# EAGLE design BHOnOfreSquareBoard (EAGLE 8.3.2)
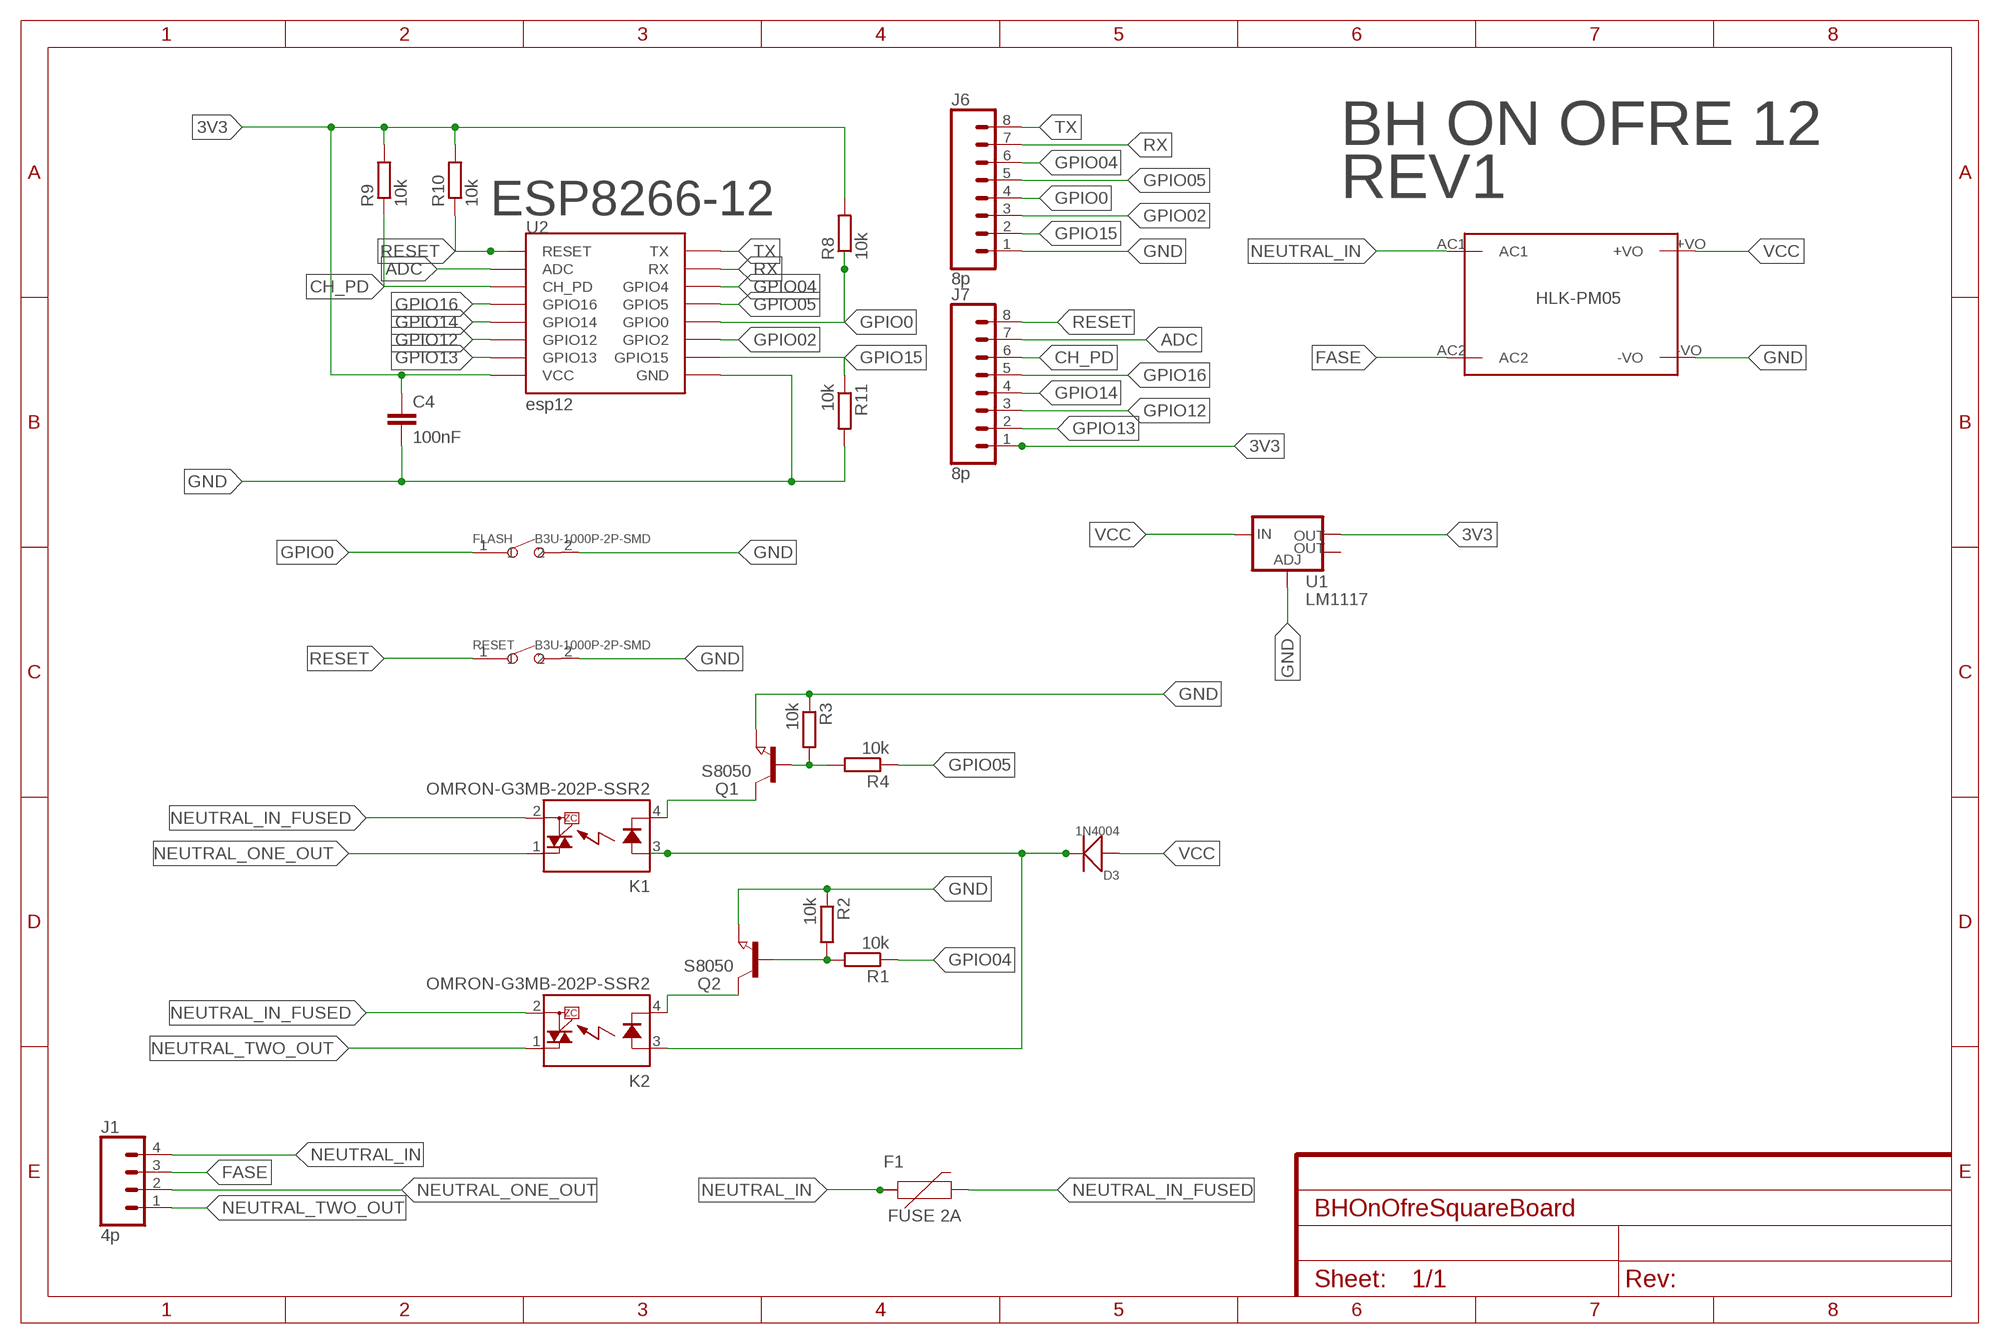
[diagram p0: schematic, sheet 1]

## Parts
C4  100nF  10NF-0603-50V-10%  [0603]
D3  1N4004  DIODE-GEN-PURPOSE-1KV-1A(DO-214AC)  [DO-214AC]
F1  FUSE 2A  PPTC_PTH  [PTH]
FLASH  B3U-1000P-2P-SMD  SMD-BUTTON(2P-3.0X2.5X1.2+0.4MM)-B3U-1000P-2P-SMD  [SW2-2.6-3.0X2.5X1.2+0.4MM]
J1  4p  CONN_04SCREW  [SCREWTERMINAL-3.5MM-4]
J6  8p  CONN_08"  [1X08]
J7  8p  CONN_08"  [1X08]
K1  OMRON-G3MB-202P-SSR2  [OMRON-G3MB-202P-SSR]
K2  OMRON-G3MB-202P-SSR2  [OMRON-G3MB-202P-SSR]
Q1  S8050  NPN-TRANSISTOR_SOT23  [SOT23]
Q2  S8050  NPN-TRANSISTOR_SOT23  [SOT23]
R1  10k  R-EU_R0603  [R0603]
R2  10k  R-EU_R0603  [R0603]
R3  10k  R-EU_R0603  [R0603]
R4  10k  R-EU_R0603  [R0603]
R8  10k  R-EU_R0603  [R0603]
R9  10k  R-EU_R0603  [R0603]
R10  10k  R-EU_R0603  [R0603]
R11  10k  R-EU_R0603  [R0603]
RESET  B3U-1000P-2P-SMD  SMD-BUTTON(2P-3.0X2.5X1.2+0.4MM)-B3U-1000P-2P-SMD  [SW2-2.6-3.0X2.5X1.2+0.4MM]
U1  LM1117  V_REG_LM1117SOT223  [SOT223]
U2  esp12  ESP12SMD  [ESP12-SMD]
U$2  HLK-PM03  [HLK-PM03]

## Nets
3V3: C4.1 J7.1 R8.2 R9.2 R10.2 U1.2(OUT) U2.VCC
ADC: J7.7 U2.ADC
CH_PD: J7.6 R9.1 U2.CH_PD
FASE: J1.3 U$2.AC2
GND: C4.2 FLASH.2 J6.1 Q1.2(E) Q2.2(E) R2.1 R3.1 R11.2 RESET.2 U1.1(ADJ) U2.GND U$2.-VO
GPIO0: FLASH.1 J6.4 R8.1 U2.GPIO0
GPIO02: J6.3 U2.GPIO2
GPIO04: J6.6 R1.1 U2.GPIO4
GPIO05: J6.5 R4.1 U2.GPIO5
GPIO12: J7.3 U2.GPIO12
GPIO13: J7.2 U2.GPIO13
GPIO14: J7.4 U2.GPIO14
GPIO15: J6.2 R11.1 U2.GPIO15
GPIO16: J7.5 U2.GPIO16
N$1: K1.4(K) Q1.3(C)
N$2: D3.2(-) K1.3(A) K2.3(A)
N$7: Q1.1(B) R3.2 R4.2
N$9: K2.4(K) Q2.3(C)
N$13: Q2.1(B) R1.2 R2.2
NEUTRAL_IN: F1.P$1 J1.4 U$2.AC1
NEUTRAL_IN_FUSED: F1.P$2 K1.2(DS2) K2.2(DS2)
NEUTRAL_ONE_OUT: J1.2 K1.1(DS1)
NEUTRAL_TWO_OUT: J1.1 K2.1(DS1)
RESET: J7.8 R10.1 RESET.1 U2.RESET
RX: J6.7 U2.RXD0(RX)
TX: J6.8 U2.TXD0(TX)
VCC: D3.1(+) U1.3(IN) U$2.+VO
Unconnected: U1.4(OUT)

## Notes on the sheet
- BH ON OFRE 12
- REV1
- ESP8266-12
- HLK-PM05

## Library data of the parts
C4 = SparkFun-Capacitors:10NF: 0.01uF/10nF/10,000pF ceramic capacitors A capacitor is a passive two-terminal electrical component used to store electrical energy temporarily in an electric field. CAP-09321; PROD_ID: CAP-00867; VALUE: 10nF
D3 = Seeed-Diode:DIODE-GEN-PURPOSE-1KV-1A(DO-214AC): 304010013; MPN: 1N4007; VALUE: 1N4007
F1 = SparkFun-Fuses:PPTC: Resettable Fuse PPTC Resettable Fuse. Really a sort of resistor with a polymeric positive temperature coefficient whose resistance increases dramatically with an increase in temperature. When heated by the power passing through the resistance rises causing the current to be limited, protecting the circuit. This is achieved by the transition of the polymer from a crystalline to an amorphous state where the conductive carbon separates breaking the conductive pathways found in the cool crystalline structure. When a PPTC cools back down it resumes conducting letting the circuit turn back on. SparkFun Products: SparkFun RedBoard - Programmed with Arduino <https://www.sparkfun.com/products/12757> Pro Micro - 5V/16MHz <https://www.sparkfun.com/products/12640> Arduino Pro 328 - 5V/16MHz <https://www.sparkfun.com/products/10915> MP3 Trigger <https://www.sparkfun.com/products/13720>; PROD_ID: RES-08490; VALUE: 72V/0.25A
FLASH RESET = Seeed-Switch:SMD-BUTTON(2P-3.0X2.5X1.2+0.4MM): 311020047; MPN: B3U-1000P-2P-SMD
J1 = SparkFun-Connectors:CONN_04: Multi connection point. Often used as Generic Header-pin footprint for 0.1 inch spaced/style header connections On any of the 0.1 inch spaced packages, you can populate with these: Break Away Headers - Straight <https://www.sparkfun.com/products/116> (PRT-00116) Break Away Male Headers - Right Angle <https://www.sparkfun.com/products/553> (PRT-00553) Female Headers <https://www.sparkfun.com/products/115> (PRT-00115) Break Away Headers - Machine Pin <https://www.sparkfun.com/products/117> (PRT-00117) Break Away Female Headers - Swiss Machine Pin <https://www.sparkfun.com/products/743> (PRT-00743) For SCREWTERMINALS and SPRING TERMINALS visit here: Screw Terimnals on SparkFun.com <https://www.sparkfun.com/search/results?term=Screw+Terminals> (5mm/3.5mm/2.54mm spacing) This device is also useful as a general connection point to wire up your design to another part of your project. Our various solder wires solder well into these plated through hole pads. Hook-Up Wire - Assortment (Stranded, 22 AWG) <https://www.sparkfun.com/products/11375> (PRT-11375) Hook-Up Wire - Assortment (Solid Core, 22 AWG) <https://www.sparkfun.com/products/11367> (PRT-11367) View the entire wire category on our website here <https://www.sparkfun.com/categories/141> Special notes: Molex polarized connector foot print use with SKU : PRT-08231 with associated crimp pins and housings. 1MM SMD Version SKU: PRT-10208; PROD_ID: 2xCONN-08399; SF_ID: 2xPRT-08084
J6 J7 = SparkFun-Connectors:CONN_08: Multi connection point. Often used as Generic Header-pin footprint for 0.1 inch spaced/style header connections On any of the 0.1 inch spaced packages, you can populate with these: Break Away Headers - Straight <https://www.sparkfun.com/products/116> (PRT-00116) Break Away Male Headers - Right Angle <https://www.sparkfun.com/products/553> (PRT-00553) Female Headers <https://www.sparkfun.com/products/115> (PRT-00115) Break Away Headers - Machine Pin <https://www.sparkfun.com/products/117> (PRT-00117) Break Away Female Headers - Swiss Machine Pin <https://www.sparkfun.com/products/743> (PRT-00743) Arduino Stackable Header - 8 Pin <https://www.sparkfun.com/products/9279> (PRT-09279) For SCREWTERMINALS and SPRING TERMINALS visit here: Screw Terimnals on SparkFun.com <https://www.sparkfun.com/search/results?term=Screw+Terminals> (5mm/3.5mm/2.54mm spacing) This device is also useful as a general connection point to wire up your design to another part of your project. Our various solder wires solder well into these plated through hole pads. Hook-Up Wire - Assortment (Stranded, 22 AWG) <https://www.sparkfun.com/products/11375> (PRT-11375) Hook-Up Wire - Assortment (Solid Core, 22 AWG) <https://www.sparkfun.com/products/11367> (PRT-11367) View the entire wire category on our website here <https://www.sparkfun.com/categories/141> Special notes: Molex polarized connector foot print use with SKU : PRT-08231 with associated crimp pins and housings. 1MM SMD Version SKU: PRT-10208 NOTES ON THE VARIANTS LOCK and LOCK_LONGPADS... This footprint was designed to help hold the alignment of a through-hole component (i.e. 6-pin header) while soldering it into place. You may notice that each hole has been shifted either up or down by 0.005 of an inch from it's more standard position (which is a perfectly straight line). This slight alteration caused the pins (the squares in the middle) to touch the edges of the holes. Because they are alternating, it causes a "brace" to hold the component in place. 0.005 has proven to be the perfect amount of "off-center" position when using our standard breakaway headers. Although looks a little odd when you look at the bare footprint, once you have a header in there, the alteration is very hard to notice. Also,if you push a header all the way into place, it is covered up entirely on the bottom side.; PROD_ID: CONN-08438
K1 K2 = Omron G3MB 202p SSR:OMRON-G3MB-202P-SSR: IT(rms) 8A, Zero Cross type SIP 4pin Triac output SSR Source: http://sharp-world.com/products/device/lineup/data/pdf/datasheet/s102s02_e.pdf; MPN: S202S02F; OC_FARNELL: 1618475; OC_NEWARK: 14N9588
Q1 Q2 = semicon-smd-ipc:NPN-TRANSISTOR_: NPN TRANSISTOR
R1-R4 R8-R11 = resistor:R-EU_: RESISTOR, European symbol
U1 = SparkFun-IC-Power:V_REG_LM1117: Voltage Regulator LM1117 Standard adjustable voltage regulator but in SMD form. Spark Fun Electronics SKU : COM-00595; PROD_ID: VREG-08170
U2 = esp8266modules:ESP12: ESP8266 Wifi module 12
U$2 = PowerSocket:HLK-PM03

## Net classes
1 220V: clearance 2.54 mm

## Board
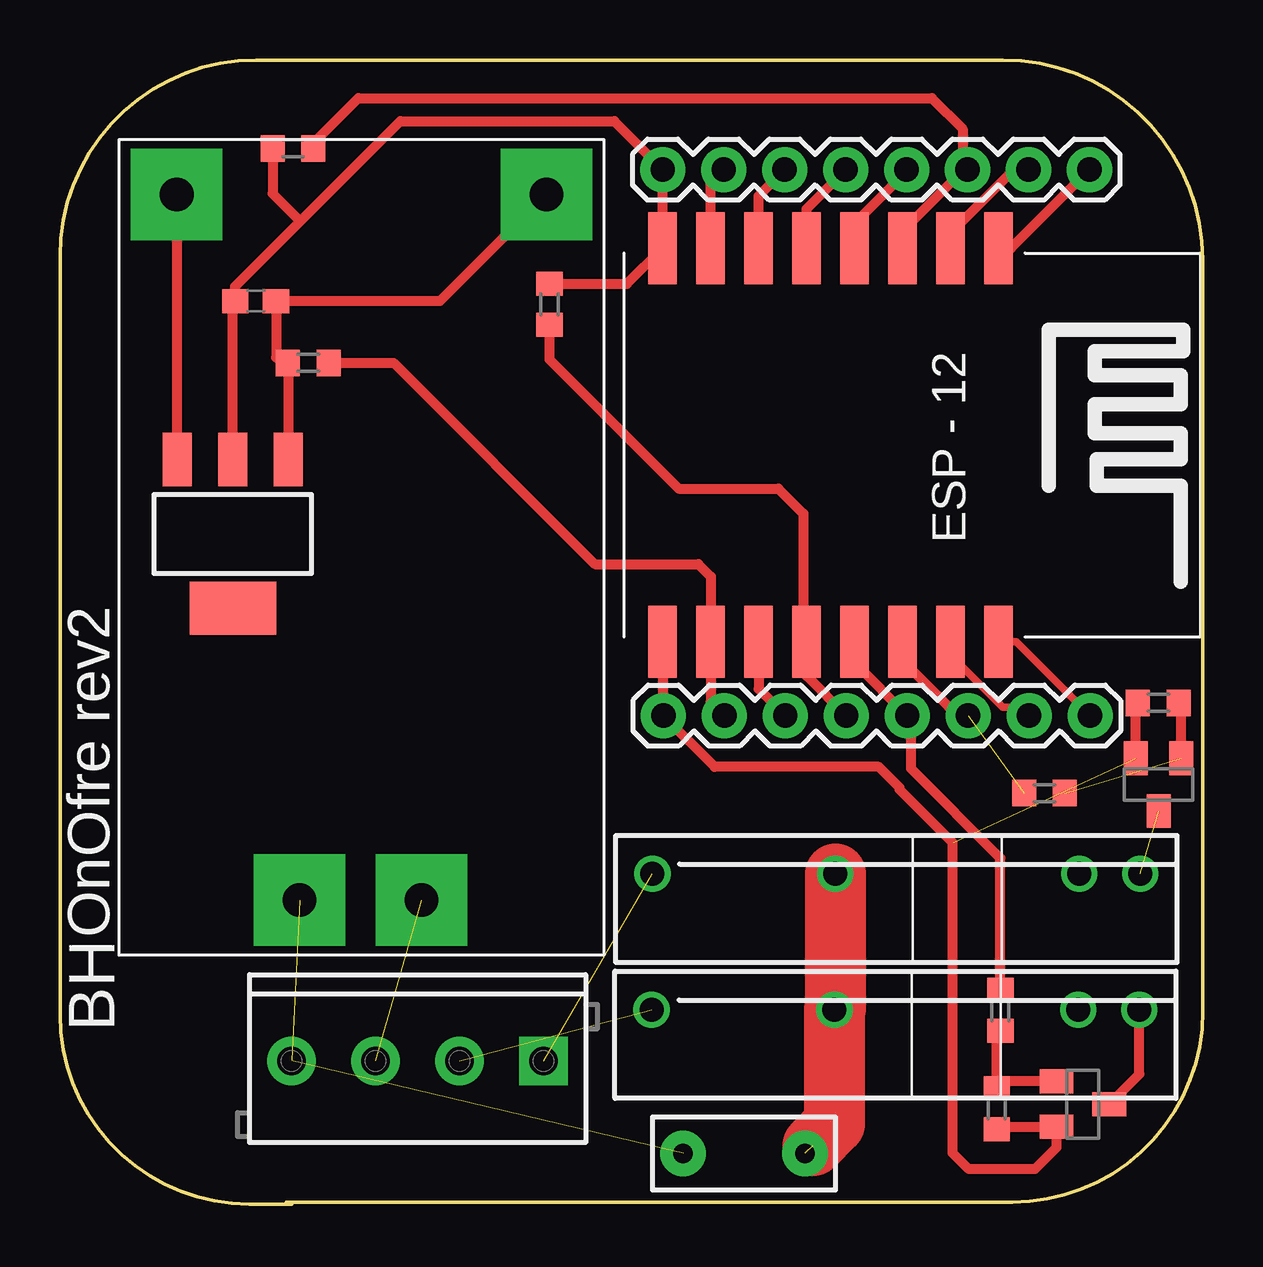
[diagram p1: board, top side]
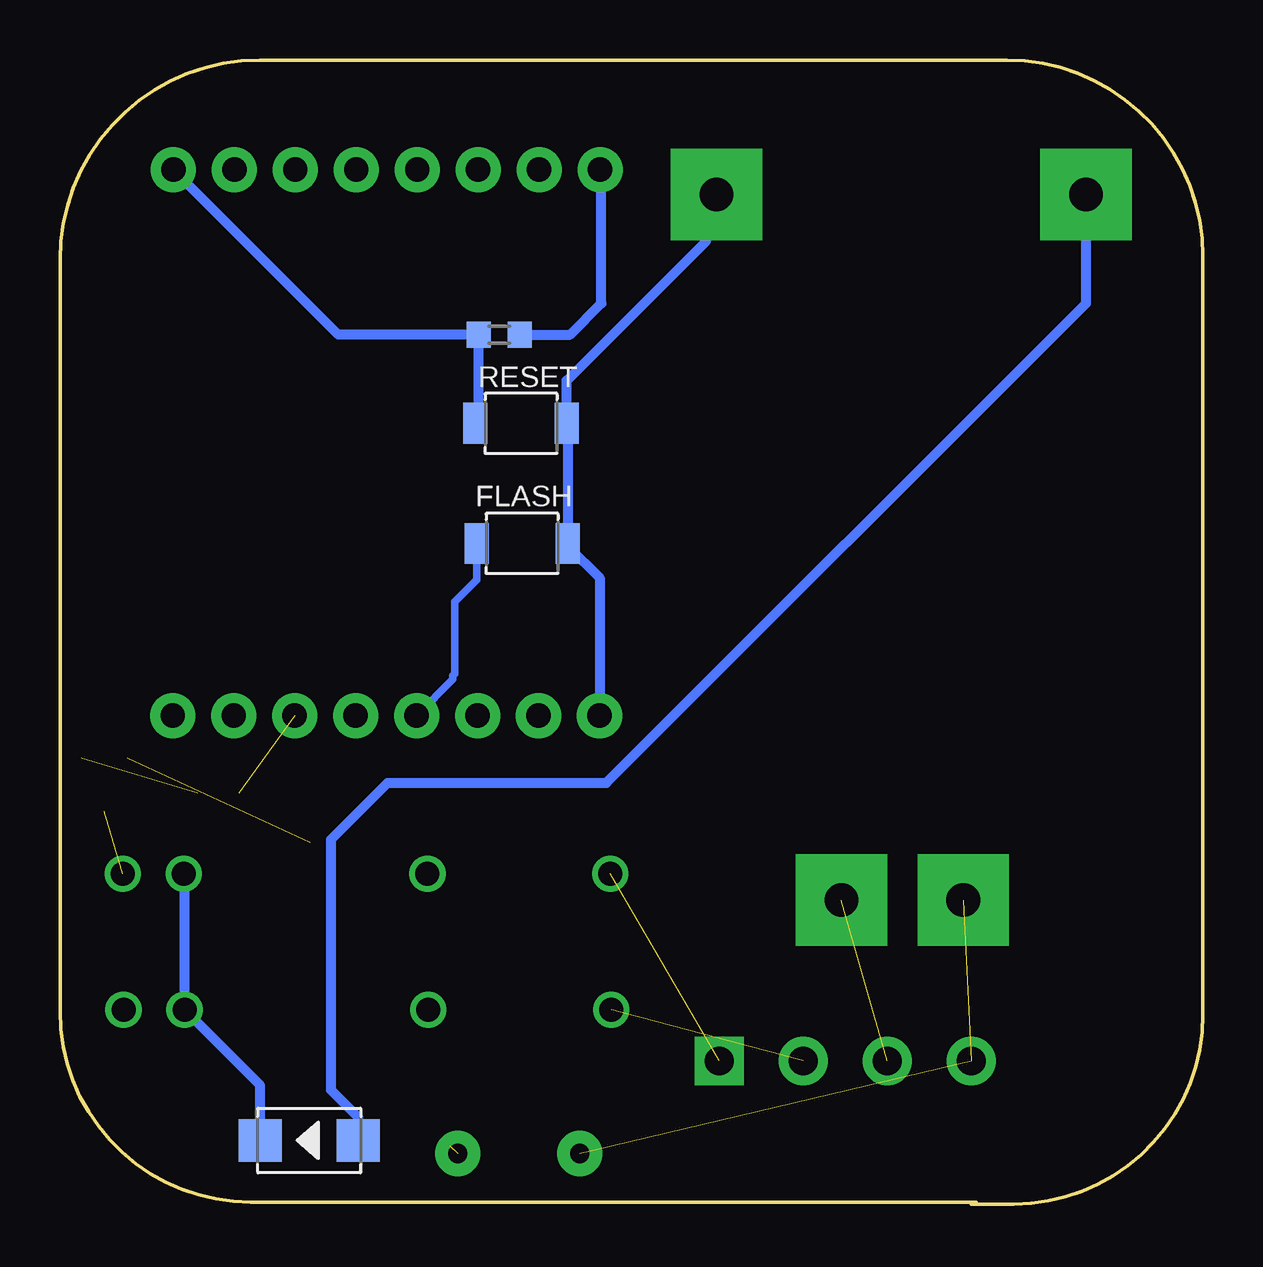
[diagram p2: board, bottom side, seen from below]

Size 47.62 x 47.67 mm. Coordinates in mm from the lower left corner, seen from the top.
Outline: 9.66,0 7.88,0 arc-90 0,7.88 0,39.5 arc-90 8.17,47.67 39.29,47.67 arc-90 47.62,39.34 47.62,8.02 arc-90 39.67,0.07 9.44,0.07
Copper layers (1*16): Top 0.035mm / dielectric 1.5mm / Bottom 0.035mm
Design rules "default": minimum track width 6mil, minimum drill 0.35mm, track to track 6mil, track to pad 6mil, pad to pad 6mil, via to via 6mil, smd to smd 6mil, copper to edge 40mil, drill to drill 6mil, minimum pad ring 10mil, minimum via ring 8mil, stop-mask expansion 4mil, vias tented up to drill 0mil, thermal gap 10mil

### Footprints (pad centres in the part's own frame; a part is rotated, then mirrored left to right if it is on the bottom)
0603 = smd 1.1 x 1: 1 -0.85,0; 2 0.85,0
DO-214AC = smd 1.8 x 1.77: 1 -2.042,0; 2 2.042,0
PTH = drill 0.8 pad 1.88: P$1 -2.54,0; P$2 2.54,0
SW2-2.6-3.0X2.5X1.2+0.4MM = smd 1 x 1.7: 1 -1.9,0; 2 1.9,0
SCREWTERMINAL-3.5MM-4 = drill 1.2 pad 2.032 square: 1 0,0 | drill 1.2 pad 2.032: 2 3.5,0; 3 7,0; 4 10.5,0
1X08 = drill 1.016 pad 1.88: 1 0,0; 2 2.54,0; 3 5.08,0; 4 7.62,0; 5 10.16,0; 6 12.7,0; 7 15.24,0; 8 17.78,0
OMRON-G3MB-202P-SSR = drill 1: 1 -12.7,0; 2 -5.08,0; 3 5.08,0; 4 7.62,0
SOT23 = smd 1 x 1.4: 1 -0.95,-1.1; 2 0.95,-1.1; 3 0,1.1
R0603 = smd 1 x 1.1: 1 -0.85,0; 2 0.85,0
SOT223 = smd 1.219 x 2.235: 1 -2.311,-3.099; 2 0,-3.099; 3 2.311,-3.099 | smd 3.6 x 2.2: 4 0,3.099
ESP12-SMD = smd 3 x 1.2: ADC -8.3,3.8; CH_PD -8.3,1.8; GND 8.1,-8.2; GPIO0 8.1,-2.2; GPIO2 8.1,-4.2; GPIO4 8.1,1.8; GPIO5 8.1,-0.2; GPIO12 -8.3,-4.2; GPIO13 -8.3,-6.2; GPIO14 -8.3,-2.2; GPIO15 8.1,-6.2; GPIO16 -8.3,-0.2; RESET -8.3,5.8; RXD0 8.1,3.8; TXD0 8.1,5.8; VCC -8.3,-8.2
HLK-PM03 = drill 1.4 pad 3.81 square: +VO 29.4,10.2; -VO 29.4,-5.2; AC1 0,5.08; AC2 0,0

### Placement (x,y rotation side)
C4  8.15,37.62 0 top
D3  37.23,2.65 180 bottom
F1  28.5,2.11 0 top
FLASH  28.36,27.52 0 bottom
J1  20.15,5.96 180 top
J6  25.14,20.35 0 top
J7  25.11,43.1 0 top
K1  37.35,8.1 0 top
K2  37.39,13.76 0 top
Q1  42.62,4.16 270 top
Q2  45.77,17.48 180 top
R1  41.02,17.12 0 top
R2  45.77,20.88 0 top
R3  39.03,3.98 90 top
R4  39.18,8.07 270 top
R8  20.39,37.49 90 top
R9  9.7,43.99 180 top
R10  29.32,36.22 0 bottom
R11  10.34,35.05 180 top
RESET  28.41,32.53 0 bottom
U1  7.2,27.92 180 top
U2  33.31,31.52 270 top
U$2  15.06,12.66 90 top

### Tracks (layer width: path | path; a pad name or v marks a point on that pad's centre or on a via)
3V3
  Top 0.406: 7.47,31.77 7.2,31.5 U1.2 7.2,37.52 C4.1 7.3,38.23 10.01,40.94 | 10.01,40.94 14.19,45.12 23.1,45.12 J7.1 U2.VCC 23.62,38.34 R8.2 | R9.2 8.85,42.1 10.01,40.94
  Bottom 0.406: R10.2 26.36,36.22 25.06,37.52 25.06,43.04 J7.1
ADC
  Top 0.406: J7.7 39.74,43.1 37.2,40.56 37.2,39.24 37.2,39.72 U2.ADC
CH_PD
  Top 0.406: R9.1 10.55,44.2 12.43,46.08 36.33,46.08 37.6,44.8 37.6,43.31 J7.6 37.66,43.1 35.25,40.68 35.25,39.96 U2.CH_PD
FASE  (1 unrouted)
GND  (1 unrouted)
  Top 0.406: Q2.2 44.83,20.79 R2.1 | R3.1 arc-90 39.12,3.21 Q1.2 41.52,2.35 40.62,1.45 37.87,1.45 37.19,2.13 37.19,15.06 36.25,16.01 34.99,17.27 34.99,17.35 34.12,18.22 27.28,18.22 J6.1 25.14,23.39 U2.GND | U$2.-VO 15.83,37.62 C4.2 9,35.28 9.51,34.77 | 9.51,34.77 U1.1 | 9.51,34.77 9.51,35.03 R11.2
  Bottom 0.406: 25.1,20.4 J6.1 25.14,26.09 26.46,27.41 FLASH.2 26.46,32.48 RESET.2 26.51,34.31 20.7,40.12 20.7,41.62 U$2.-VO
GPIO0
  Top 0.406: 31.11,23.01 U2.GPIO0 | 31.11,23.01 31.11,22.01 J6.4 | R8.1 20.39,35.19 25.78,29.81 29.93,29.81 30.97,28.77 30.97,23.15 31.11,23.01
  Bottom 0.305: FLASH.1 30.26,26.01 31.17,25.09 31.17,22.1 31.25,22.02 31.25,21.86 J6.4
GPIO02
  Top 0.406: U2.GPIO2 29.11,21.47 J6.3
GPIO04  (1 unrouted)
  Top 0.406: U2.GPIO4 35.11,22.64 37.05,20.7 37.5,20.7 J6.6
GPIO05
  Top 0.406: J6.5 35.44,20.21 | R4.1 39.18,14.41 35.46,18.14 35.46,20.19 J6.5 | U2.GPIO5 33.11,22.55 J6.5
GPIO12
  Top 0.406: U2.GPIO12 29.11,42.01 J7.3
GPIO13
  Top 0.406: U2.GPIO13 27.11,42.55 J7.2
GPIO14
  Top 0.406: U2.GPIO14 31.11,41.47 J7.4
GPIO15
  Top 0.406: R11.1 13.9,35.05 22.28,26.66 26.6,26.66 27.11,26.14 27.11,24.12 U2.GPIO15 27.11,20.93 J6.2
GPIO16
  Top 0.406: J7.5 35.27,43.03 33.01,40.76 33.01,39.32 33.01,39.73 U2.GPIO16
N$1
  Top 0.406: Q1.3 44.97,5.41 K1.4
N$2
  Bottom 0.406: K2.3 42.43,13.72 K1.3 39.27,4.95 D3.2
N$7
  Top 0.406: Q1.1 39.32,5.11 arc90 R3.2 39.03,7.07 arc-90 R4.2
N$9  (1 unrouted)
N$13  (1 unrouted)
  Top 0.406: Q2.1 46.73,20.77 R2.2
NEUTRAL_IN  (2 unrouted)
NEUTRAL_IN_FUSED  (1 unrouted)
  Top 2.54: K2.2 32.31,8.14 K1.2 32.27,3.34 31.37,2.44
NEUTRAL_ONE_OUT  (1 unrouted)
NEUTRAL_TWO_OUT  (1 unrouted)
RESET
  Top 0.406: U2.RESET 39.62,39.82 J7.8
  Bottom 0.406: RESET.1 30.17,32.67 R10.1 36.02,36.22 J7.8
RX
  Top 0.305: U2.RXD0 37.11,22.87 39.28,20.7 40.04,20.7 J6.7
TX
  Top 0.305: U2.TXD0 39.85,23.42 J6.8
VCC
  Top 0.406: U1.3 4.89,42.04 U$2.+VO
  Bottom 0.406: D3.1 35.19,3.62 36.32,4.75 36.32,15.19 33.97,17.54 24.85,17.54 4.87,37.53 U$2.+VO

### Text on the board
tNames: OnOfre rev2 | BH